# Altium schematic sheet RF.SchDoc
size A4
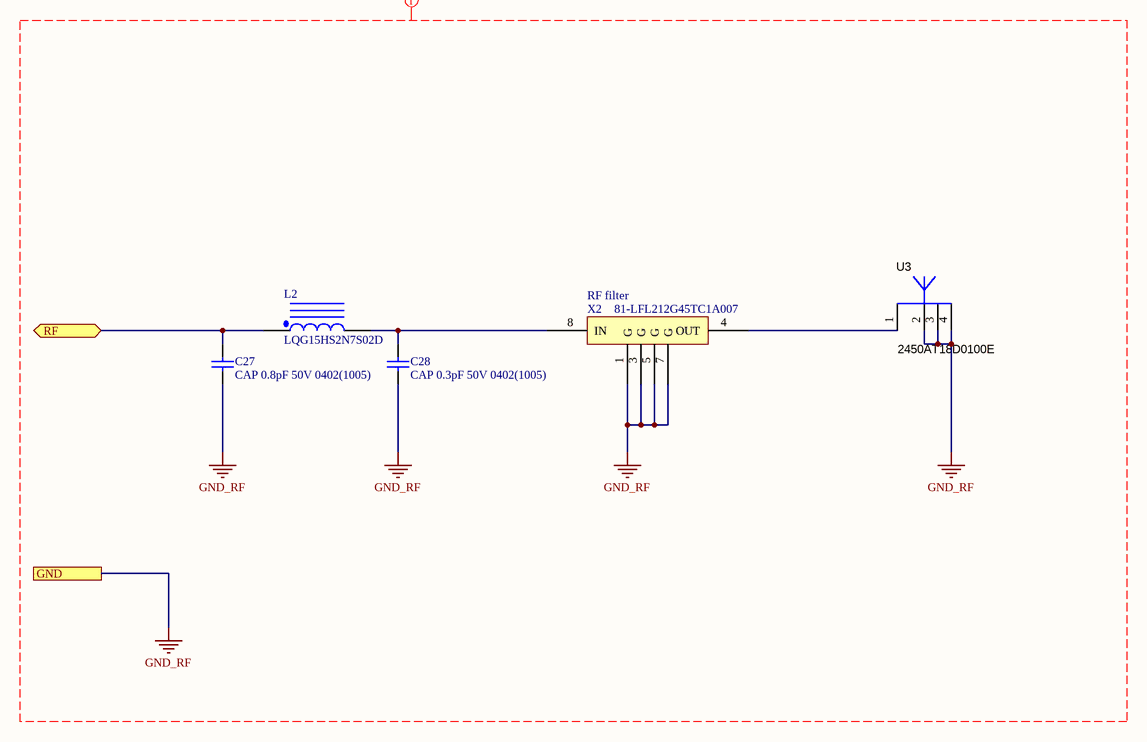
[diagram p0: RF.SchDoc]

## Parts
C27  CAP 0.8pF 50V 0402(1005)  [CAPC0402(1005)60_N]
C28  CAP 0.3pF 50V 0402(1005)  [CAPC0402(1005)60_M]
L2  LQG15HS2N7S02D  [INDC1005X55X25LL05T10_A]
U3  2450AT18D0100E  [JT-2450AT18D0100E_V]
X2  RF filter  Supplier Part Number 1: 81-LFL212G45TC1A007  [LFL21_TC]

## Ports
GND, RF (bidir)

## Nets
GND_RF: C27.1 C28.1 U3.2(GND) U3.3(GND) U3.4(GND) X2.1(G) X2.3(G) X2.5(G) X2.7(G) ; port GND
RF: C27.2 L2.1 ; port RF
NetC28_2: C28.2 L2.2 X2.8(IN)
NetU3_1: U3.1(Feeding_Point) X2.4(OUT)

## Layout directives
mark named RF: GND_RF

## Library data of the parts
C27 = CMP-1034-00043-1: CAP 0.8pF 50V ±0.1pF 0402 (1005 Metric) Thickness 0.6mm SMD; Case-EIA: 0402; Case-Metric: 1005; Tolerance: Â±0.1pF; Max Thickness: 0.6 mm; Technology: SMT; Value: 0.8pF; Rated Voltage: 50 V
C28 = CMP-1034-00007-1: CAP 0.3pF 50V ±0.05pF 0402 (1005 Metric) Thickness 0.6mm SMD; Tolerance: Â±0.05pF; Case-EIA: 0402; Case-Metric: 1005; Value: 0.3pF; Max Thickness: 0.6 mm; Technology: SMT; Rated Voltage: 50 V
L2 = CMP-2000-06580-1: Chip Inductor, 2.7 nH, +/- 0.3 nH, 300 mA, -55 to 125 degC, 0402 (1005 Metric), RoHS, Tape and Reel; Manufacturer: Murata; Type: Multilayer; Inductance: 2.7nH; Frequency - Self Resonant: 6GHz; Shielding: Unshielded; Online Catalog: LQG15HxSeries; Other Names: 490-2615-2; Catalog Drawings: LQG15HSSeriesTopLQG15HSSeriesEnd; Q @ Freq: 8@100MHz; DC Resistance (DCR): 150mOhmMax; Frequency - Test: 100MHz; Product Training Modules: InductorProducts; Current Rating: 300mA; Material - Core: Air; Tolerance: ±0.3nH; Package Description: 2-Pin Surface Mount Device, Body 1 x 0.5 mm; Mounting Technology: SurfaceMount; Height - Seated (Max): 0.022"(0.55mm); Category: Inductors,Coils,Chokes; Package / Case: 0402(1005Metric); Package Reference: 0402; Standard Package: 10,000; Operating Temperature: -55°C~125°C; Mounting Type: SurfaceMount; Packaging: Tape&Reel(TR); Series: LQG15HS; Datasheet URL: http://search.murata.co.jp/Ceramy/image/img/PDF/ENG/L0075S0083LQG15HS.pdf; Manufacturer URL: http://www.murata.com/; Family: FixedInductors; Size / Dimension: 0.039"Lx0.020"W(1.00mmx0.50mm); Datasheet Version: 09/2010
U3 = CMP-2000-05543-1: Chip RF Antenna, 2.4 to 2.5 GHz, -40 to 125 degC, 4-Pin SMD, RoHS, Tape and Reel; Manufacturer: Johanson Technology; Number of Bands: 1; Gain: 1.5dBi; Return Loss: -10dB; Power - Max: 2W; Frequency Group: UHF(2GHz~3GHz); Online Catalog: JohansonTechnologyInc-Embedded; Frequency (Center/Band): 2.4GHz; Other Names: 712-1573-2; Frequency Range: 2.4GHz~2.5GHz; Series: -; Antenna Type: Chip; Features: -; Applications: -; Category: RF/IFandRFID; Height (Max): 0.047"(1.20mm); Standard Package: 3,000; Package Reference: 2450AT18D0100E; Package Description: 4-Pin Surface Mount Device, Body 3.2 x 1.6 mm; Datasheet Version: Rev. 3.0, 09/2015; Manufacturer URL: https://www.johansontechnology.com/; Datasheet URL: http://www.johansontechnology.com/datasheets/antennas/2450AT18D0100.pdf; Mounting Type: SurfaceMount; Termination: Solder; VSWR: -; Mounting Technology: SurfaceMount; Ingress Protection: -; Family: RFAntennas; Packaging: Tape&Reel(TR)
X2 = LFL212G45TC1A007: Supplier 1: Mouser